# EAGLE design Basic LiPo Charger (EAGLE 8.2.0)
CNAME: LiPo Battery Charger Breakout; CREVISION: V1.0; DESIGNER: November Five
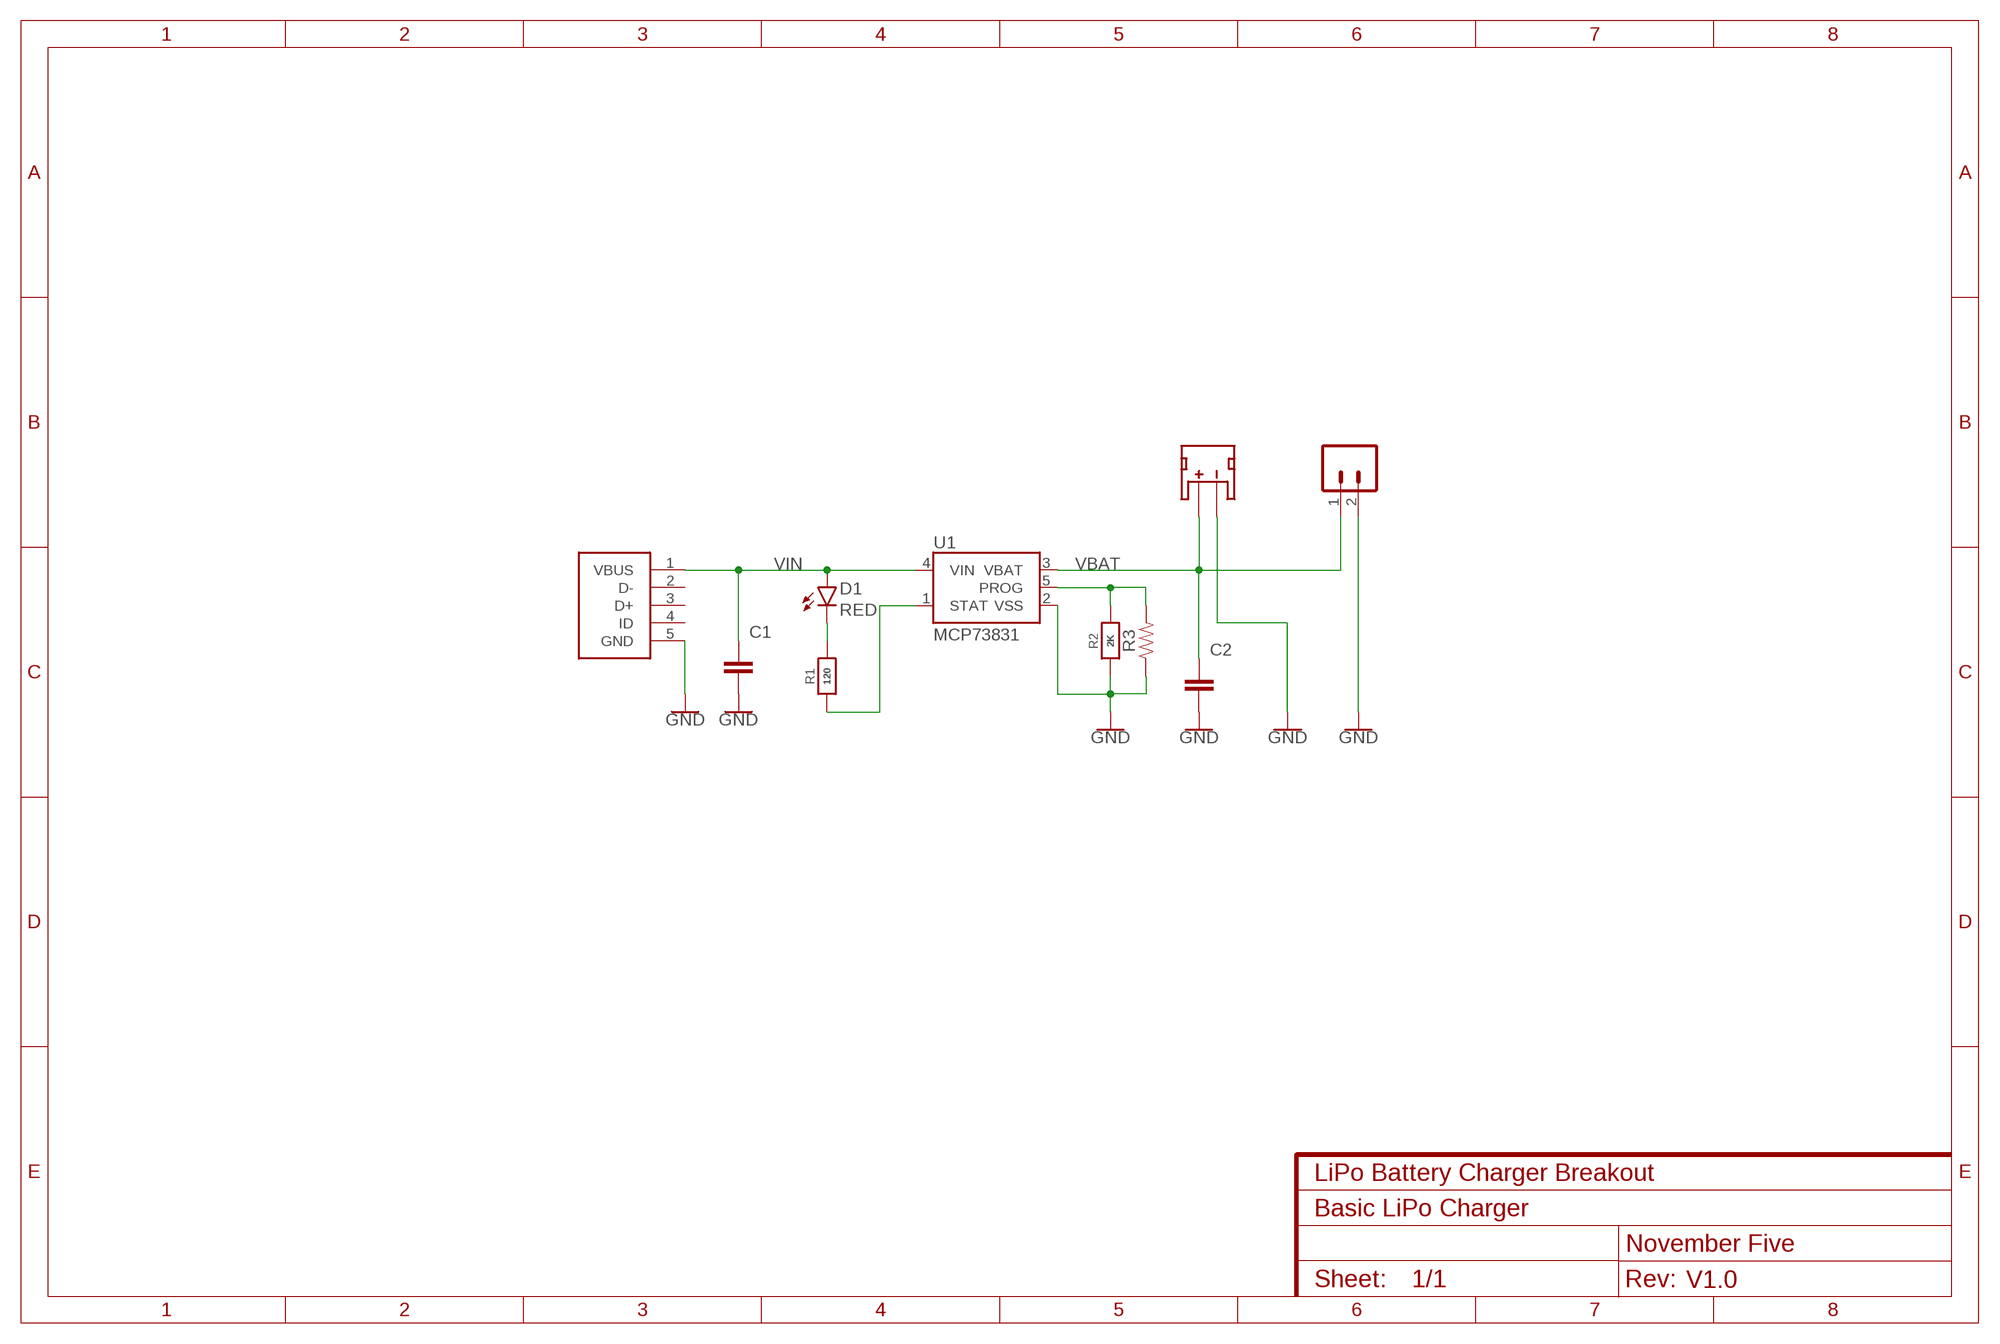
[diagram p0: schematic, sheet 1]

## Parts
C1  4.7uF  CAPACITOR  [C0603]
C2  4.7uF  CAPACITOR  [C0603]
D1  RED  LED-RED0603  [LED-0603]
J1  USB-CON-5PIN-105017-0001  [USB-MICRO-MOLEX-105017-0001]
J2  JST_2MM_MALE  [JST-2-SMD]
J3  CONN_02  [1X02]
R1  120  RESISTOR  [R0603]
R2  2K  RESISTOR  [R0603]
R3  10MOHM-HORIZ-1/4W-5%  [AXIAL-0.3]
U1  MCP73831  [SOT23-5]

## Nets
GND: C1.2 C2.2 J1.5(GND) J2.1(-) J3.2 R2.1 R3.P$1 U1.2(VSS)
N$1: D1.C R1.2
PROG: R2.2 R3.P$2 U1.5(PROG)
STAT: R1.1 U1.1(STAT)
VBAT: C2.1 J2.2(+) J3.1 U1.3(VBAT)
VIN: C1.1 D1.A J1.1(VBUS) U1.4(VIN)
Unconnected: J1.2(D-) J1.3(D+) J1.4(ID) J2.NC1(PAD1) J2.NC2(PAD2)

## Library data of the parts
C1 C2 = NovemberFive-Basic:CAPACITOR
D1 = SparkFun-LED:LED-RED: Red SMD LED Used in manufacturing of most products at SparkFun Packages: 0603 - SMD 0603 package [Product Link] <http://docs.avagotech.com/docs/AV02-0551EN> 0603 SMART - SMD 0603 SMART package ( more efficient and expensive)[Product Link] <http://www.osram-os.com/Graphics/XPic2/00077099_0.pdf> 1206 - SMD1206 package [Product Link] <https://www.sparkfun.com/datasheets/DevTools/LilyPad/Q150OVS4.pdff> SparkFun Products: Pro Mini 328 -5V <https://www.sparkfun.com/products/821> RedBoard <https://www.sparkfun.com/products/12757> IOIO-OTG <https://www.sparkfun.com/products/13613>; PROD_ID: DIO-00819
J1 = NovemberFive-Connectors:USB-CON-5PIN: Molex Micro USB 105017-0001
J2 = SparkFun-Connectors:JST_2MM_MALE: JST 2MM MALE RA CONNECTOR Two pin, compact surface mount connector. Commonly used as a battery input connection point. We really like the solid locking feeling and high current rating on these small connectors. We use these all the time as battery connectors. Mates to single-cell LiPo batteries. Here is the connector we sell at SparkFun: JST Right Angle Connector - White <https://www.sparkfun.com/products/8612> (PRT-08612) Datasheet <http://www.sparkfun.com/datasheets/Prototyping/Connectors/JST-Horizontal.pdf> It was used on these SparkFun products: SparkFun MOSFET Power Controller <https://www.sparkfun.com/products/11214> (PRT-11214) SparkFun Battery Babysitter - LiPo Battery Manager <https://www.sparkfun.com/products/13777> (PRT-13777) And many, many others that required a lipo battery connection.; PROD_ID: CONN-11443; SF_ID: PRT-08612
J3 = SparkFun-Connectors:CONN_02: Multi connection point. Often used as Generic Header-pin footprint for 0.1 inch spaced/style header connections On any of the 0.1 inch spaced packages, you can populate with these: Break Away Headers - Straight <https://www.sparkfun.com/products/116> (PRT-00116) Break Away Male Headers - Right Angle <https://www.sparkfun.com/products/553> (PRT-00553) Female Headers <https://www.sparkfun.com/products/115> (PRT-00115) Break Away Headers - Machine Pin <https://www.sparkfun.com/products/117> (PRT-00117) Break Away Female Headers - Swiss Machine Pin <https://www.sparkfun.com/products/743> (PRT-00743) For SCREWTERMINALS and SPRING TERMINALS visit here: Screw Terimnals on SparkFun.com <https://www.sparkfun.com/search/results?term=Screw+Terminals> (5mm/3.5mm/2.54mm spacing) This device is also useful as a general connection point to wire up your design to another part of your project. Our various solder wires solder well into these plated through hole pads. Hook-Up Wire - Assortment (Stranded, 22 AWG) <https://www.sparkfun.com/products/11375> (PRT-11375) Hook-Up Wire - Assortment (Solid Core, 22 AWG) <https://www.sparkfun.com/products/11367> (PRT-11367) View the entire wire category on our website here <https://www.sparkfun.com/categories/141> Special notes: Molex polarized connector foot print use with: PRT-08233 with associated crimp pins and housings. 2.54_SCREWTERM for use with PRT-10571. 3.5mm Screw Terminal footprints for PRT-08084 5mm Screw Terminal footprints for use with PRT-08432
R1 R2 = NovemberFive-Basic:RESISTOR
R3 = SparkFun-Resistors:10MOHM: RES-09327; PROD_ID: RES-09327; VALUE: 10M
U1 = SparkFun-IC-Power:MCP73831: MCP73831T Li-Ion, Li-Pol Controller Miniature single cell, fully integrated Li-Ion, Li-polymer charge management controller Datasheet <http://ww1.microchip.com/downloads/en/DeviceDoc/20001984g.pdf> SparkFun Products: SparkFun ESP32 Thing <https://www.sparkfun.com/products/13907> SparkFun 9DoF Razor IMU M0 <https://www.sparkfun.com/products/14001>; PROD_ID: IC-09995

## Board
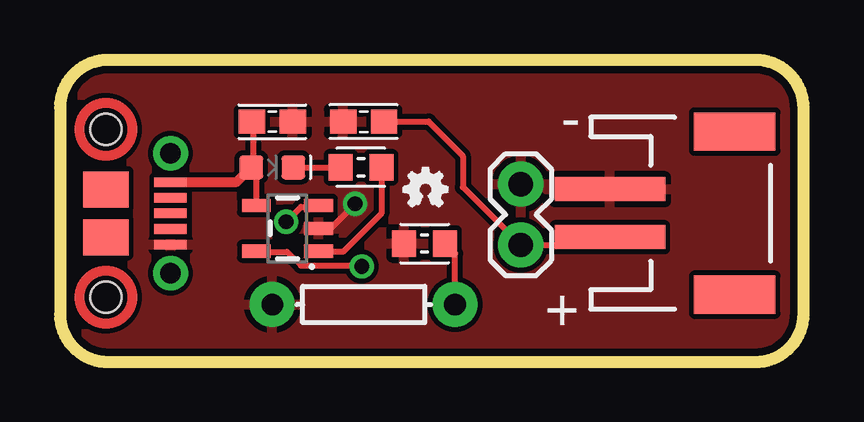
[diagram p1: board, top side]
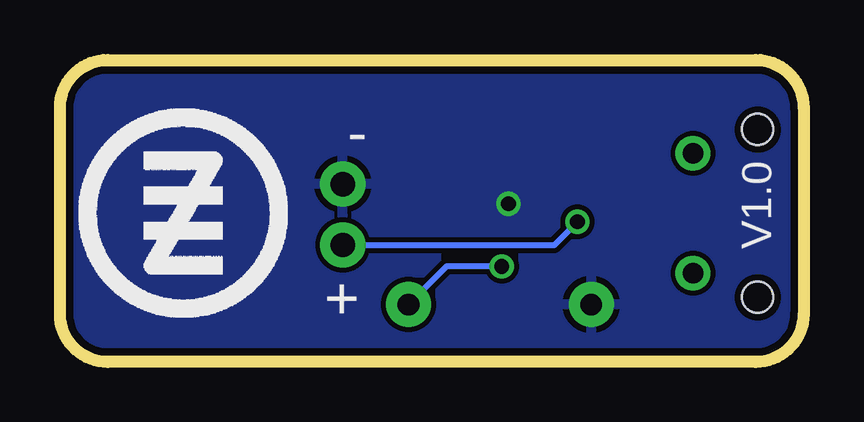
[diagram p2: board, bottom side, seen from below]

Size 31 x 12.6 mm. Coordinates in mm from the lower left corner, seen from the top.
Outline: 2,12.6 arc90 0,10.6 0,2 arc90 2,0 29,0 arc90 31,2 31,10.6 arc90 29,12.6 1.8,12.6
Copper layers (1*16): Top 0.035mm / dielectric 1.5mm / Bottom 0.035mm
Design rules "default *": minimum track width 10mil, minimum drill 24mil, track to track 8mil, track to pad 8mil, pad to pad 8mil, via to via 8mil, smd to smd 8mil, copper to edge 12mil, drill to drill 8mil, minimum pad ring 10mil, minimum via ring 8mil, stop-mask expansion 4mil, vias tented up to drill 0mil, thermal gap 10mil

### Footprints (pad centres in the part's own frame; a part is rotated, then mirrored left to right if it is on the bottom)
C0603 = smd 1.1 x 1: 1 -0.85,0; 2 0.85,0
LED-0603 = smd 1 x 1: A -0.877,0; C 0.877,0
USB-MICRO-MOLEX-105017-0001 = smd 0.4 x 1.35: 1 1.2,0; 2 1.85,0; 3 2.5,0; 4 3.15,0; 5 3.8,0 | drill 0.85 pad 1.45: P$1 0,0; P$2 5,0 | smd 1.5 x 1.9: P$3 3.5,-2.7; P$4 1.5,-2.7 | hole 1.3: -1,-2.7; 6,-2.7
JST-2-SMD = smd 1 x 4.6: 1 -1,-3.7; 2 1,-3.7 | smd 1.6 x 3.4: NC1 -3.4,1.5; NC2 3.4,1.5
1X02 = drill 1.016 pad 1.88: 1 0,0; 2 2.54,0
R0603 = smd 1 x 1.1: 1 -0.85,0; 2 0.85,0
AXIAL-0.3 = drill 0.9 pad 1.88: P$1 -3.81,0; P$2 3.81,0
SOT23-5 = smd 0.55 x 1.2: 1 -0.95,-1.3; 2 0,-1.3; 3 0.95,-1.3; 4 0.95,1.3; 5 -0.95,1.3

### Placement (x,y rotation side)
C1  8.85,10.02 0 top
C2  12.66,10.03 180 top
D1  8.85,8.12 0 top
J1  4.61,8.7 270 top
J2  26.63,6.21 270 top
J3  19.21,4.88 90 top
R1  12.55,8.12 180 top
R2  15.2,4.94 0 top
R3  12.66,2.4 0 top
U1  9.48,5.58 90 top
U$1  [LOGO-NOVEMERFIVE-5SCALE]  30.21,10.55 90 top
U$2  [LOGO-OSHWA]  14.05,6.4 0 top

### Tracks (layer width: path | path; a pad name or v marks a point on that pad's centre or on a via)
GND  (via drill 0.61)
  Top 0.254: U1.2 11.28,5.58 v12.3,6.6
  pour Top: -0.8,12.8 31.6,12.8 31.6,-0.6 -0.8,-0.6
  pour Bottom: -0.6,12.8 31.4,12.8 31.4,-0.6 -0.6,-0.6
N$1
  Top 0.254: D1.C R1.2
PROG  (via drill 0.61)
  Top 0.254: U1.5 8.3,4.6 9.47,4.6 10.05,4.02 12.55,4.02 v12.58,3.99 | R3.P$2 16.47,4.52 R2.2
  Bottom 0.254: v12.58,3.99 14.88,3.99 R3.P$2
STAT
  Top 0.254: R1.1 13.4,6.2 11.8,4.6 10.81,4.6 U1.1
VBAT  (via drill 0.61)
  Top 0.254: v9.43,5.85 10.05,6.48 10.68,6.48 U1.3 | J2.2 22.72,5 22,5 21.88,4.88 J3.1 16.8,7.29 16.8,8.6 15.37,10.03 C2.1
  Bottom 0.254: J3.1 10.39,4.88 v9.43,5.85
VIN
  Top 0.254: C1.1 8.05,9.98 8.05,8.23 D1.A 8.18,8.23 8.18,6.6 U1.4
  Top 0.406: J1.1 7.37,7.51 D1.A

### Text on the board
tPlace: - | +
bPlace: - | V1.0 | +